# Altium schematic sheet project_1_1.SchDoc
size A4; SheetNumber: 1; SheetTotal: 1
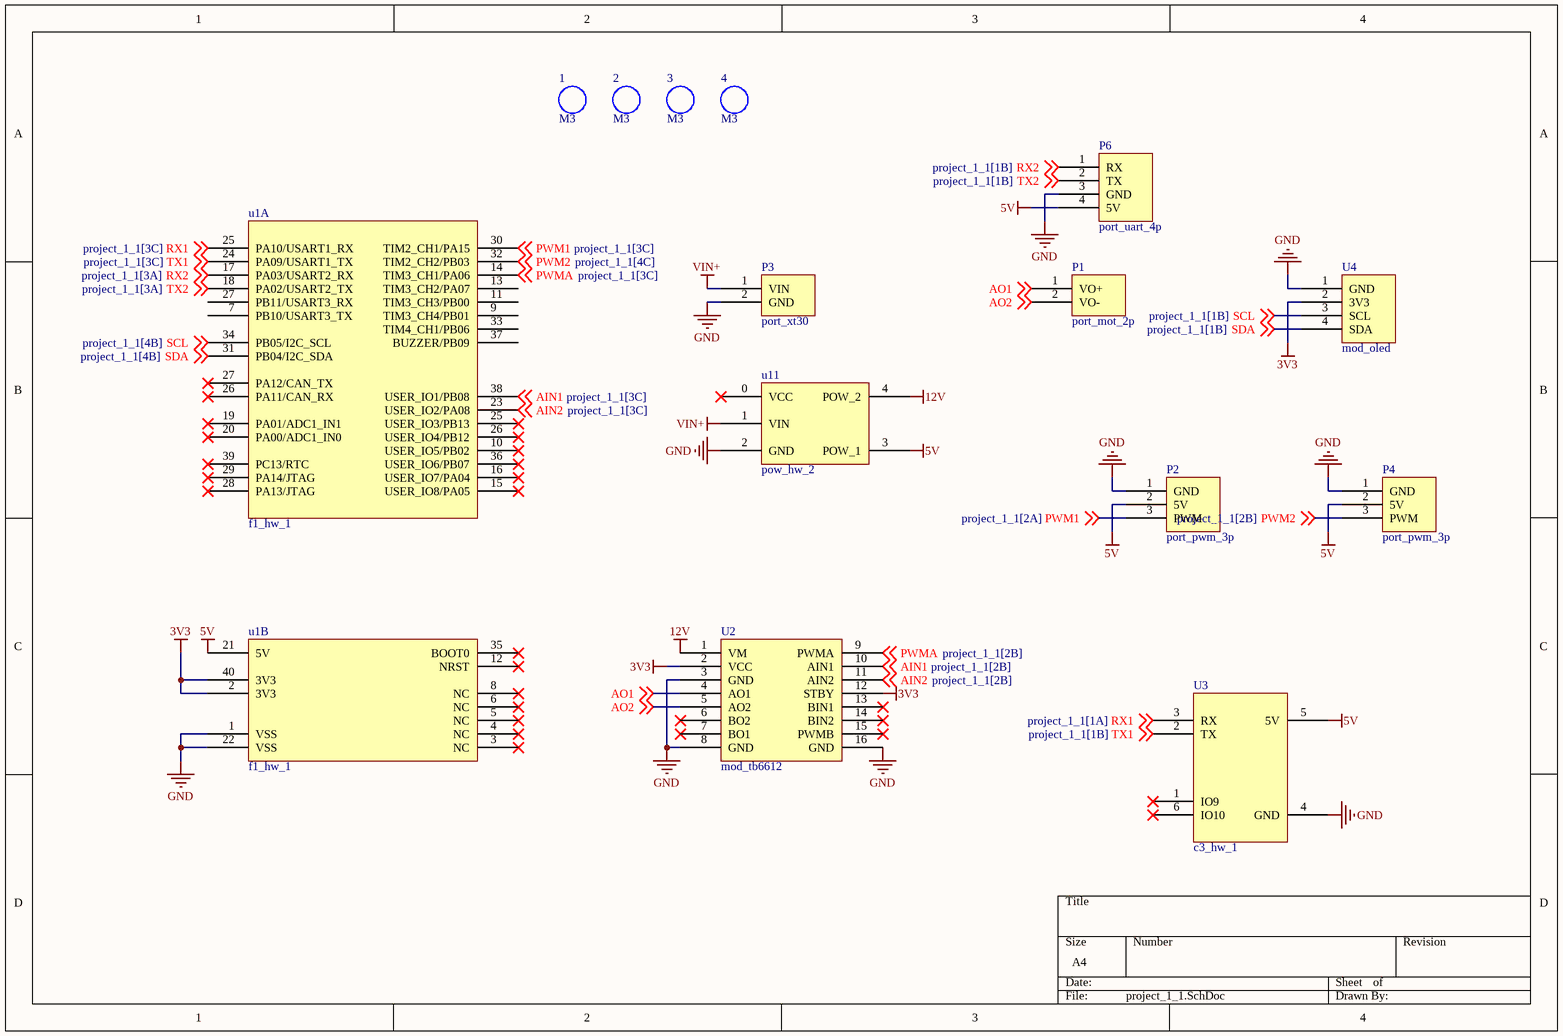
[diagram p0: project_1_1.SchDoc]

## Parts
1  M3  [M3 125X200]
2  M3  [M3 125X200]
3  M3  [M3 125X200]
4  M3  [M3 125X200]
P1  port_mot_2p  [XH2.54_2P]
P2  port_pwm_3p  [XH2.54_3P]
P3  port_xt30  [MOD_XT30]
P4  port_pwm_3p  [XH2.54_3P]
P6  port_uart_4p  [XH2.54_4P]
u1  f1_hw_1  [f1_hw_1]  (parts A,B of 2)
U2  mod_tb6612  [MOD_TB6612]
U3  c3_hw_1  [C3_HW_1]
U4  mod_oled  [mod_oled]
u11  pow_hw_2  [pow_hw_2]

## Nets
3V3: u1.2(3V3) u1.40(3V3) U2.2(VCC) U2.12(STBY) U4.2(3V3)
5V: P2.2(5V) P4.2(5V) P6.4(5V) u1.21(5V) U3.5(5V) u11.3(POW_1)
12V: U2.1(VM) u11.4(POW_2)
GND: P2.1(GND) P3.2(GND) P4.1(GND) P6.3(GND) u1.1(VSS) u1.22(VSS) U2.3(GND) U2.8(GND) U2.16(GND) U3.4(GND) U4.1(GND) u11.2(GND)
VIN+: P3.1(VIN) u11.1(VIN)
AIN1: u1.38(USER_IO1/PB08) U2.10(AIN1) ; off-sheet AIN1
AIN2: u1.23(USER_IO2/PA08) U2.11(AIN2) ; off-sheet AIN2
AO1: P1.1(VO+) U2.4(AO1) ; off-sheet AO1
AO2: P1.2(VO-) U2.5(AO2) ; off-sheet AO2
PWM1: P2.3(PWM) u1.30(TIM2_CH1/PA15) ; off-sheet PWM1
PWM2: P4.3(PWM) u1.32(TIM2_CH2/PB03) ; off-sheet PWM2
PWMA: u1.14(TIM3_CH1/PA06) U2.9(PWMA) ; off-sheet PWMA
RX1: u1.25(PA10/USART1_RX) U3.3(RX) ; off-sheet RX1
RX2: P6.1(RX) u1.17(PA03/USART2_RX) ; off-sheet RX2
SCL: u1.34(PB05/I2C_SCL) U4.3(SCL) ; off-sheet SCL
SDA: u1.31(PB04/I2C_SDA) U4.4(SDA) ; off-sheet SDA
TX1: u1.24(PA09/USART1_TX) U3.2(TX) ; off-sheet TX1
TX2: P6.2(TX) u1.18(PA02/USART2_TX) ; off-sheet TX2

Not connected (* = marked no-connect by the designer): u1 3(NC)* 4(NC)* 5(NC)* 6(NC)* 7(PB10/USART3_TX) 8(NC)* 9(TIM3_CH4/PB01) 10(USER_IO5/PB02)* 11(TIM3_CH3/PB00) 12(NRST)* 13(TIM3_CH2/PA07) 15(USER_IO8/PA05)* 16(USER_IO7/PA04)* 19(PA01/ADC1_IN1)* 20(PA00/ADC1_IN0)* 26(PA11/CAN_RX)* 27(PA12/CAN_TX)* 28(PA13/JTAG)* 29(PA14/JTAG)* 33(TIM4_CH1/PB06) 35(BOOT0)* 36(USER_IO6/PB07)* 37(BUZZER/PB09) 39(PC13/RTC)*; U2 6(BO2)* 7(BO1)* 13(BIN1)* 14(BIN2)* 15(PWMB)*; U3 1(IO9)* 6(IO10)*; u11 0(VCC)*

## Library data of the parts
1-4 = prot_m3: m3铜柱孔; BOM名称: 铜柱孔; 版权归属: 源创客; 学习资源: www.ooocke.com
P1 = port_mot_2p: 开环直流电机接口 / XH2.54弯排针2p
P2 P4 = port_pwm_3p: 舵机接口 / XH2.54弯排针3p
P3 = port_xt30: XT30
P6 = port_uart_4p: 串口接口/SPP蓝牙模块 / XH2.54弯排针4p/4p排母
u1 = f1_hw_1: F103C8T6最小系统_1
U2 = mod_tb6612: TB6612模块 / 8p排母*2
U3 = c3_hw_1: ESP32C3蓝牙模块 / 6p排母
U4 = mod_oled: 外购屏幕模块
u11 = pow_hw_2: 两路升降压电源模块 / 6p排母*2